# EAGLE design Qwiic_RF (EAGLE 7.7.0)
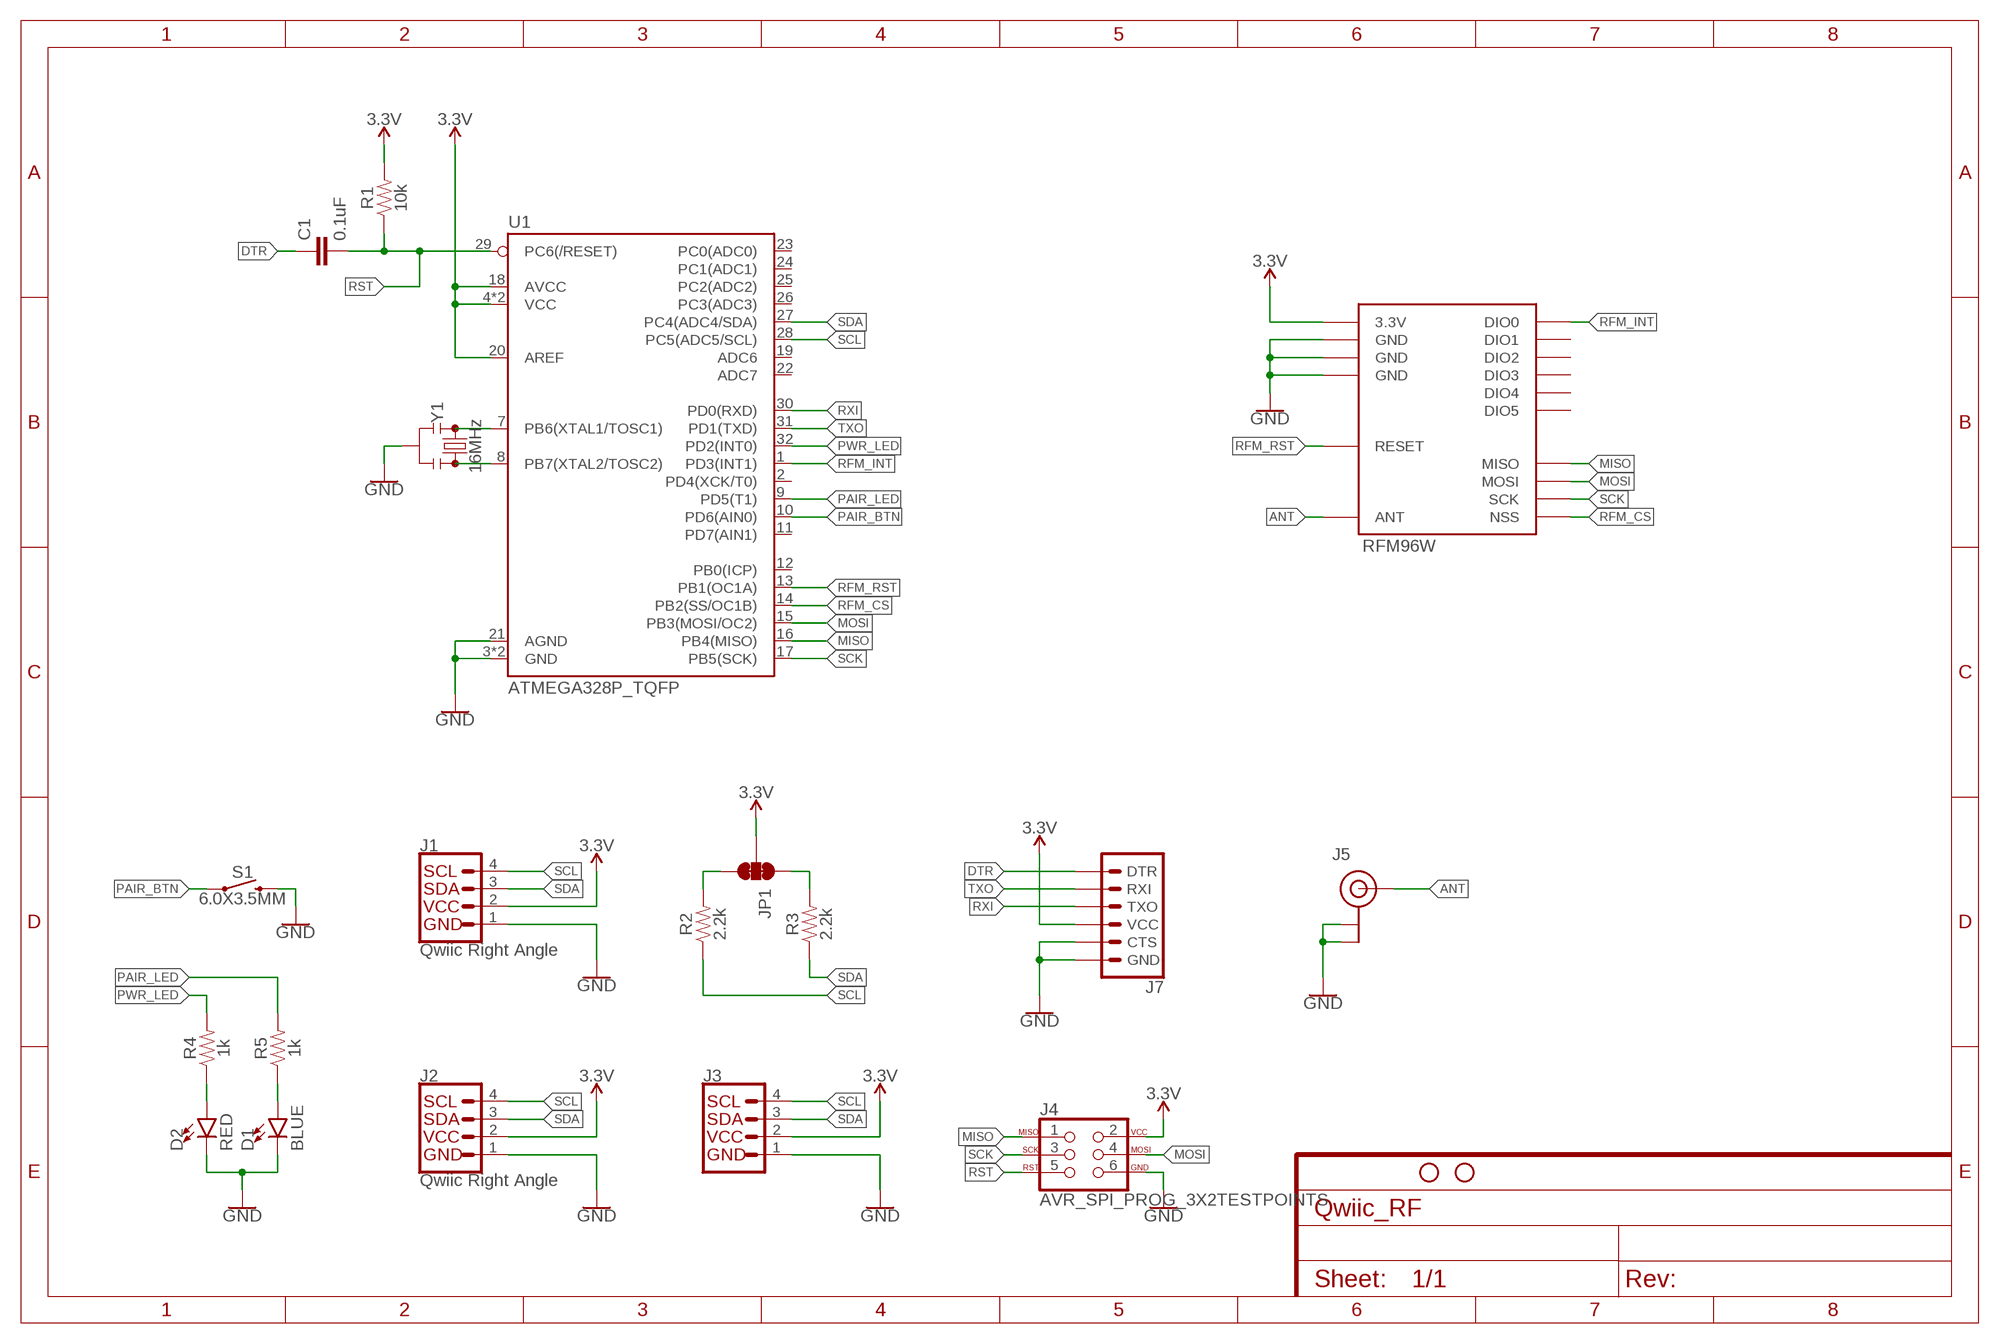
[diagram p0: schematic, sheet 1]

## Parts
C1  0.1uF  0.1UF-0603-25V-(+80/-20%)  [0603]
D1  BLUE  LED-BLUE0603  [LED-0603]
D2  RED  LED-RED0603  [LED-0603]
H1  STAND-OFF  [STAND-OFF]
H2  STAND-OFF  [STAND-OFF]
J1  Qwiic Right Angle  I2C_STANDARDQWIIC  [1X04_1MM_RA]
J2  Qwiic Right Angle  I2C_STANDARDQWIIC  [1X04_1MM_RA]
J3  I2C_STANDARD  [1X04]
J4  AVR_SPI_PROG_3X2TESTPOINTS  [2X3_TEST_POINTS]
J5  U.FL  [U.FL]
J7  6_PIN_SERIAL_TARGET  [1X06]
JP1  JUMPER-SMT_3_2-NC_TRACE_SILK  [SMT-JUMPER_3_2-NC_TRACE_SILK]
R1  10k  10KOHM-0603-1/10W-1%  [0603]
R2  2.2k  2.2KOHM-0603-1/10W-1%  [0603]
R3  2.2k  2.2KOHM-0603-1/10W-1%  [0603]
R4  1k  1KOHM-0603-1/10W-1%  [0603]
R5  1k  1KOHM-0603-1/10W-1%  [0603]
RFM96W  RFM96W  [RFM95/96/97/98W]
S1  6.0X3.5MM  MOMENTARY-SWITCH-SPST-SMD-6.0X3.5MM  [TACTILE_SWITCH_SMD_6.0X3.5MM]
U1  ATMEGA328P_TQFP  [TQFP32-08]
Y1  16MHz  RESONATOR-16MHZSMD_3.2X1.3  [RESONATOR-SMD-3.2X1.3]

## Nets
3.3V: J1.2 J2.2 J3.2 J4.2 J7.4(VCC) JP1.2 R1.2 RFM96W.3.3V U1.4(VCC) U1.6(VCC) U1.18(AVCC) U1.20(AREF)
ANT: J5.FEED(SIGNAL) RFM96W.ANT
DTR: C1.1 J7.1(DTR)
GND: D1.C D2.C J1.1 J2.1 J3.1 J4.6 J5.1(GND) J5.2(GND) J7.5(CTS) J7.6(GND) RFM96W.GND@1(GND) RFM96W.GND@2(GND) RFM96W.GND@3(GND) S1.2 U1.3(GND) U1.5(GND) U1.21(AGND) Y1.2
MISO: J4.1 RFM96W.MISO U1.16(PB4(MISO))
MOSI: J4.4 RFM96W.MOSI U1.15(PB3(MOSI/OC2))
N$1: D2.A R4.1
N$2: D1.A R5.1
N$4: U1.7(PB6(XTAL1/TOSC1)) Y1.1
N$5: U1.8(PB7(XTAL2/TOSC2)) Y1.3
N$7: JP1.1 R3.2
N$8: JP1.3 R2.2
PAIR_BTN: S1.1 U1.10(PD6(AIN0))
PAIR_LED: R5.2 U1.9(PD5(T1))
PWR_LED: R4.2 U1.32(PD2(INT0))
RFM_CS: RFM96W.NSS U1.14(PB2(SS/OC1B))
RFM_INT: RFM96W.DIO0 U1.1(PD3(INT1))
RFM_RST: RFM96W.RESET U1.13(PB1(OC1A))
RST: C1.2 J4.5 R1.1 U1.29(PC6(/RESET))
RXI: J7.3(TXO) U1.30(PD0(RXD))
SCK: J4.3 RFM96W.SCK U1.17(PB5(SCK))
SCL: J1.4 J2.4 J3.4 R2.1 U1.28(PC5(ADC5/SCL))
SDA: J1.3 J2.3 J3.3 R3.1 U1.27(PC4(ADC4/SDA))
TXO: J7.2(RXI) U1.31(PD1(TXD))
Unconnected: RFM96W.DIO1 RFM96W.DIO2 RFM96W.DIO3 RFM96W.DIO4 RFM96W.DIO5 U1.2(PD4(XCK/T0)) U1.11(PD7(AIN1)) U1.12(PB0(ICP)) U1.19(ADC6) U1.22(ADC7) U1.23(PC0(ADC0)) U1.24(PC1(ADC1)) U1.25(PC2(ADC2)) U1.26(PC3(ADC3))

## Library data of the parts
C1 = SparkFun-Capacitors:0.1UF: 0.1µF ceramic capacitors A capacitor is a passive two-terminal electrical component used to store electrical energy temporarily in an electric field.; PROD_ID: CAP-00810
D1 = SparkFun-LED:LED-BLUE: Blue SMD LED Used in manufacturing of various products at SparkFun Packages: 0603 - SMD 0603 package [Product Link] <http://www.digikey.com/product-detail/en/SMLE12BC7TT86/511-1589-2-ND/1641808> 1206 - SMD1206 package [Product Link] <http://www.digikey.com/product-detail/en/lite-on-inc/LTST-C150TBKT/160-1643-1-ND/573584> SparkFun Products: ESP8266 Thing-Dev Board <https://www.sparkfun.com/products/13711> RedBoard <https://www.sparkfun.com/products/12757>; PROD_ID: DIO-08575
D2 = SparkFun-LED:LED-RED: Red SMD LED Used in manufacturing of most products at SparkFun Packages: 0603 - SMD 0603 package [Product Link] <http://docs.avagotech.com/docs/AV02-0551EN> 0603 SMART - SMD 0603 SMART package ( more efficient and expensive)[Product Link] <http://www.osram-os.com/Graphics/XPic2/00077099_0.pdf> 1206 - SMD1206 package [Product Link] <https://www.sparkfun.com/datasheets/DevTools/LilyPad/Q150OVS4.pdff> SparkFun Products: Pro Mini 328 -5V <https://www.sparkfun.com/products/821> RedBoard <https://www.sparkfun.com/products/12757> IOIO-OTG <https://www.sparkfun.com/products/13613>; PROD_ID: DIO-00819
H1 H2 = SparkFun-Hardware:STAND-OFF: Stand Off Drill holes for mechanically mounting via screws, standoffs, etc. Note: Use the keepout ring to avoid running the screw head into surrounding components. Variant Overviews STAND-OFF - Mechanical footprint for a #4 phillips button head screw. STAND-OFF-TIGHT - Mechanical footprint for a #4 phillips button head screw, Example SparkFun Products Screw - Phillips Head (1/4", 4-40, 10 pack) <https://www.sparkfun.com/products/10453> (PRT-10453) Screw - Phillips Head (1/2", 4-40, 10 pack) <https://www.sparkfun.com/products/10452> (PRT-10452) Screw - Phillips Head (3/4", 4-40, 10 pack) <https://www.sparkfun.com/products/10451> (PRT-10451) Screw - Phillips Head (1", 4-40, 10 pack) <https://www.sparkfun.com/products/10450> (PRT-10450)
J1 J2 = SparkFun-Connectors:I2C_STANDARD: SparkFun I2C Standard Pinout Header SparkFun has standardized on a pinout for all I2C based sensor breakouts. This pinout allows I2C boards to be plugged directly into the headers on Arduino Uno compatible boards, and to be daisy chained easily. Example SparkFun Products: SparkFun Atmospheric Sensor Breakout - BME280 <https://www.sparkfun.com/products/13676> SparkFun Altitude/Pressure Sensor Breakout - MPL3115A2 <https://www.sparkfun.com/products/11084> SparkFun TOF Range Finder Sensor - VL6180 <https://www.sparkfun.com/products/12785>; PROD_ID: CONN-13694
J3 = SparkFun-Connectors:I2C_STANDARD: SparkFun I2C Standard Pinout Header SparkFun has standardized on a pinout for all I2C based sensor breakouts. This pinout allows I2C boards to be plugged directly into the headers on Arduino Uno compatible boards, and to be daisy chained easily. Example SparkFun Products: SparkFun Atmospheric Sensor Breakout - BME280 <https://www.sparkfun.com/products/13676> SparkFun Altitude/Pressure Sensor Breakout - MPL3115A2 <https://www.sparkfun.com/products/11084> SparkFun TOF Range Finder Sensor - VL6180 <https://www.sparkfun.com/products/12785>
J4 = SparkFun-Connectors:AVR_SPI_PROG_3X2: AVR ISP 6 Pin This is the reduced ISP connector for AVR programming. Common on Arduino. This footprint will take up less PCB space and can be used with a 10-pin to 6-pin adapter such as SKU: BOB-08508 **Special note about "TEST_POINT" package. The stop mask is on the top side, so if you want your programming test points to be on the bottom of your board, make sure to place this package on the bottom side of the board. This also ensure that the orientation to program from the bottom side will be correct. SparkFun Products: SparkFun ISP Pogo Adapter <https://www.sparkfun.com/products/11591> - NS Tiny AVR Programmer <https://www.sparkfun.com/products/11801> -PTH
J5 = SparkFun-Connectors:U.FL: SMD Antenna Connector - U.FL 2mm height, 3.0mm x 3.0mm receptacle size. SparkFun Products: SparkFun WiFi Shield - ESP8266 <https://www.sparkfun.com/products/13287> SparkFun ESP8266 Thing <https://www.sparkfun.com/products/13231> SparkFun MiniGen - Pro Mini Signal Generator Shield <https://www.sparkfun.com/products/11420>; PROD_ID: CONN-09193; SF_ID: WRL-09144
J7 = SparkFun-Connectors:6_PIN_SERIAL_TARGET: 6-pin header connection for use with the "FTDI BASIC" pinout - TARGET SIDE. Also known as "Arduino Serial Program Header". It is used to mate with our FTDI Basic serial programmers using the Arduino IDE. Note, this device has "TARGET" in the name. It is intended to be used on a design that contains a target micro-controller that you wish to program. The "sister" device, named "CABLE" is inteneded to be used on a design that usually lives on the end of your USB cable and prvides the converter chip (FTDI232 or FTDI231x) to commnicate serial RX/TX. You can populate with some of these: Break Away Headers - Straight <https://www.sparkfun.com/products/116> (PRT-00116) For reference (or to suit your programming needs) check out these designs: SparkFun FTDI Basic Breakout - 5V <https://www.sparkfun.com/products/9716> (DEV-09716) SparkFun FTDI Basic Breakout - 3.3V <https://www.sparkfun.com/products/9873> (DEV-09873) SparkFun FTDI SmartBasic <https://www.sparkfun.com/products/12935> (DEV-12935) SparkFun Beefy 3 - FTDI Basic Breakout <https://www.sparkfun.com/products/13746> (DEV-13746)
JP1 = SparkFun-Jumpers:JUMPER-SMT_3_2-NC_TRACE: Normally closed trace jumper (2 of 2 connections) This jumper has a trace between all three pads so they are normally closed (NC). Use a razor knife to open the connection(s). For best results follow the IPC guidelines for cutting traces: Cutout at least 0.063 mm (0.005 in). Remove all loose material to clean up the cut area. Seal the cut with an approved epoxy. Reapply solder to reclose the connection(s).
R1 = SparkFun-Resistors:10KOHM: 10kΩ resistor A resistor is a passive two-terminal electrical component that implements electrical resistance as a circuit element. Resistors act to reduce current flow, and, at the same time, act to lower voltage levels within circuits. - Wikipedia; PROD_ID: RES-00824
R2 R3 = SparkFun-Resistors:2.2KOHM: 2.2kΩ resistor A resistor is a passive two-terminal electrical component that implements electrical resistance as a circuit element. Resistors act to reduce current flow, and, at the same time, act to lower voltage levels within circuits. - Wikipedia; PROD_ID: RES-08272
R4 R5 = SparkFun-Resistors:1KOHM: 1kΩ resistor A resistor is a passive two-terminal electrical component that implements electrical resistance as a circuit element. Resistors act to reduce current flow, and, at the same time, act to lower voltage levels within circuits. - Wikipedia; PROD_ID: RES-07856
RFM96W = SparkX:RFM96W
S1 = SparkFun-Switches:MOMENTARY-SWITCH-SPST: Momentary Switch (Pushbutton) - SPST Normally-open (NO) SPST momentary switches (buttons, pushbuttons). Variants PTH-12MM - 12mm square, through-hole Momentary Pushbutton Switch - 12mm Square <https://www.sparkfun.com/products/9190> (COM-09190) PTH-6.0MM, PTH-6.0MM-KIT - 6.0mm square, through-hole Mini Pushbutton Switch <https://www.sparkfun.com/products/97> (COM-00097) KIT package intended for soldering kit's - only one side of pads' copper is exposed. PTH-RIGHT-ANGLE-KIT - Right-angle, through-hole Right Angle Tactile Button <https://www.sparkfun.com/products/10791> - Used on SparkFun BigTime Watch Kit <https://www.sparkfun.com/products/11734> SMD-12MM - 12mm square, surface-mount Tactile Button - SMD (12mm) <https://www.sparkfun.com/products/12993> (COM-12993) Used on SparkFun PicoBoard <https://www.sparkfun.com/products/11888> SMD-4.5MM - 4.5mm Square Trackball Switch Used on SparkFun Blackberry Trackballer Breakout <https://www.sparkfun.com/products/13169> SMD-4.6MMX2.8MM - 4.60mm x 2.80mm, surface mount Used on SparkFun SAMD21 Mini Breakout <https://www.sparkfun.com/products/13664> SMD-5.2MM, SMD-5.2-REDUNDANT - 5.2mm square, surface-mount Mini Pushbutton Switch - SMD <https://www.sparkfun.com/products/8720> (COM-08720) Used on Arduino Pro Mini <https://www.sparkfun.com/products/11114> REDUNDANT package connects both switch circuits together SMD-6.0X3.5MM - 6.0 x 3.5mm, surface mount Momentary Reset Switch SMD <https://www.sparkfun.com/products/8229> (COM-08229) SMD-6.2MM-TALL - 6.2mm square, surface mount Tactile Button - SMD (6mm) <https://www.sparkfun.com/products/12992> Used on SparkFun Digital Sandbox <https://www.sparkfun.com/products/12651> SMD-RIGHT-ANGLE - Right-angle, surface mount Used on SparkFun Block for Intel® Edison - Arduino <https://www.sparkfun.com/products/13036>; PROD_ID: SWCH-00815; SF_SKU: COM-08229
U1 = SparkFun-IC-Microcontroller:ATMEGA328P_TQFP: Popular 328P in QFP Storefront component: ATmega328 - TQFP <https://www.sparkfun.com/products/13448> (COM-13448) Datasheet <http://www.sparkfun.com/datasheets/Components/SMD/ATMega328.pdf> SparkFun Products SparkFun RedBoard - Programmed with Arduino <https://www.sparkfun.com/products/12757> (DEV-12757) Arduino Pro Mini 328 - 5V/16MHz <https://www.sparkfun.com/products/11113> (DEV-11113) Arduino Pro Mini 328 - 3.3V/8MHz <https://www.sparkfun.com/products/11114> (DEV-11114) SparkFun OpenLog <https://www.sparkfun.com/products/13712> (DEV-13712) SparkFun MicroView - OLED Arduino Module <https://www.sparkfun.com/products/12923> (DEV-12923) SparkFun Digital Sandbox <https://www.sparkfun.com/products/12651> (DEV-12651) SparkFun PicoBoard <https://www.sparkfun.com/products/11888> (WIG-11888) Arduino Fio <https://www.sparkfun.com/products/10116> (DEV-10116) LilyPad Arduino 328 Main Board <https://www.sparkfun.com/products/13342> (DEV-13342) SparkFun RedStick <https://www.sparkfun.com/products/13741> (DEV-13741) LilyPad MP3 <https://www.sparkfun.com/products/11013> (DEV-11013) LilyPad Arduino SimpleSnap <https://www.sparkfun.com/products/10941> (DEV-10941) SparkFun Stepoko <https://www.sparkfun.com/products/13899> (ROB-13899) SparkFun Geiger Counter <https://www.sparkfun.com/products/11345> (SEN-11345) SparkFun EL Sequencer <https://www.sparkfun.com/products/12781> (COM-12781) Arduino Pro 328 - 5V/16MHz <https://www.sparkfun.com/products/10915> (DEV-10915) CryptoCape <https://www.sparkfun.com/products/12773> (DEV-12773) SparkFun IR Thermometer Evaluation Board - MLX90614 <https://www.sparkfun.com/products/10740> (SEN-10740) SparkFun RedBot Mainboard <https://www.sparkfun.com/products/12097> (ROB-12097) Arduino Pro 328 - 3.3V/8MHz <https://www.sparkfun.com/products/10914> (DEV-10914) SparkFun Block for Intel® Edison - Arduino <https://www.sparkfun.com/products/13036> (DEV-13036) SparkFun Simon Says - Surface Mount Soldering Kit <https://www.sparkfun.com/products/10935> (KIT-10935) SparkFun 7-Segment Serial Display - Red <https://www.sparkfun.com/products/11441> (COM-11441) SparkFun 7-Segment Serial Display - White <https://www.sparkfun.com/products/11629> (COM-11629) SparkFun 7-Segment Serial Display - Yellow <https://www.sparkfun.com/products/11443> (COM-11443) SparkFun 7-Segment Serial Display - Kelly Green <https://www.sparkfun.com/products/11440> (COM-11440) SparkFun 7-Segment Serial Display - Blue <https://www.sparkfun.com/products/11442> (COM-11442) SparkFun OpenSegment Serial Display - 20mm (Blue) <https://www.sparkfun.com/products/11647> (COM-11647) SparkFun OpenSegment Serial Display - 20mm (Green) <https://www.sparkfun.com/products/11646> (COM-11646) SparkFun OpenSegment Serial Display - 20mm (White) <https://www.sparkfun.com/products/11648> (COM-11648) SparkFun OpenSegment Serial Display - 20mm (Red) <https://www.sparkfun.com/products/11644> (COM-11644) SparkFun OpenSegment Serial Display - 20mm (Yellow) <https://www.sparkfun.com/products/11645> (COM-11645) SparkFun OpenSegment Shield <https://www.sparkfun.com/products/13190> (DEV-13190); PROD_ID: IC-09069
Y1 = SparkFun-Clocks:RESONATOR-16MHZ: 16MHz Resonator Digikey Example <http://www.digikey.com/product-detail/en/murata-electronics-north-america/CSTCE16M0V53-R0/490-1198-1-ND/584635> Frequency: 16MHz Frequency Stability: ±0.3% Frequency Tolerance: ±0.5% Capacitance: 15pF SparkFun Products SparkFun OpenLog <https://www.sparkfun.com/products/13712> SparkFun MicroView - OLED Arduino Module <https://www.sparkfun.com/products/12923>; PROD_ID: XTAL-08900

## Board
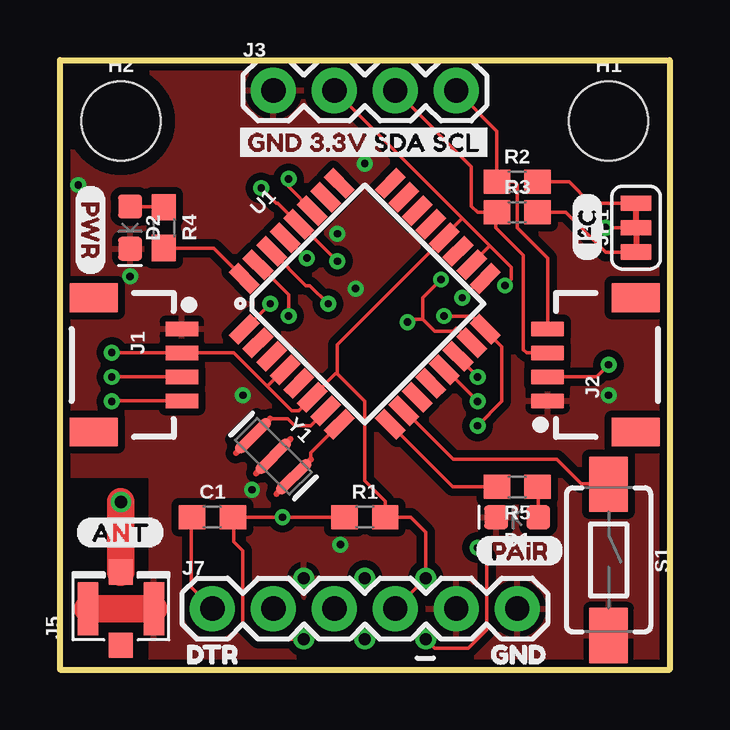
[diagram p1: board, top side]
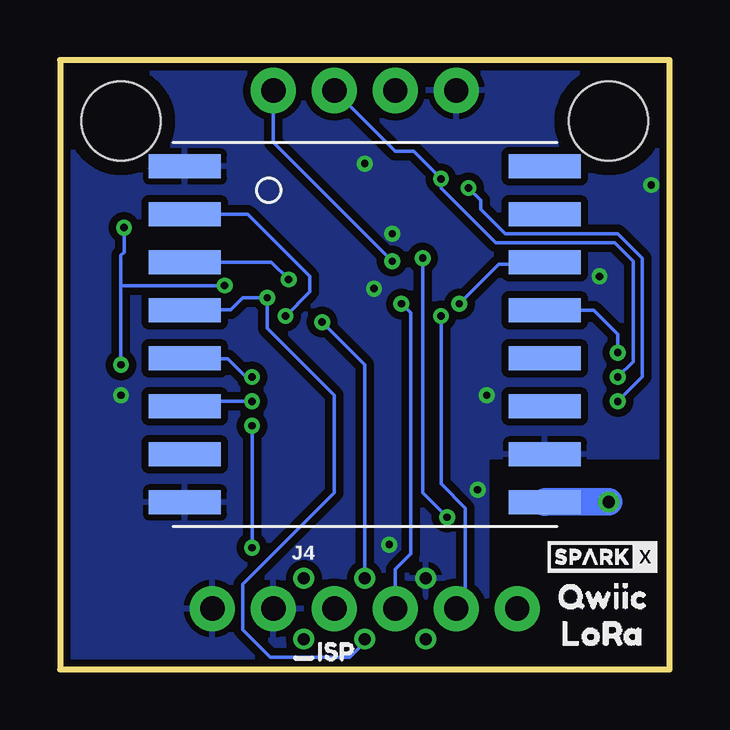
[diagram p2: board, bottom side, seen from below]

Size 25.4 x 25.4 mm. Coordinates in mm from the lower left corner, seen from the top.
Outline: 0,25.4 25.4,25.4 25.4,0 0,0 0,25.4
Copper layers (1*16): Top 0.035mm / dielectric 1.5mm / Bottom 0.035mm
Design rules "SparkFun-2-layer-PCBWay-LIMIT": minimum track width 6mil, minimum drill 0.3mm, track to track 6mil, track to pad 6mil, pad to pad 6mil, via to via 6mil, smd to smd 6mil, copper to edge 6mil, drill to drill 6mil, minimum pad ring 7mil, minimum via ring 7mil, stop-mask expansion 4mil, vias tented up to drill 25mil, thermal gap 10mil

### Footprints (pad centres in the part's own frame; a part is rotated, then mirrored left to right if it is on the bottom)
0603 = smd 1.1 x 1: 1 -0.85,0; 2 0.85,0
LED-0603 = smd 1 x 1: A -0.877,0; C 0.877,0
STAND-OFF = hole 3.302: 0,0
1X04_1MM_RA = smd 0.6 x 1.35: 1 -1.5,0; 2 -0.5,0; 3 0.5,0; 4 1.5,0 | smd 1.2 x 2: NC1 2.8,-3.675; NC2 -2.8,-3.675
1X04 = drill 1.016 pad 1.88: 1 0,0; 2 2.54,0; 3 5.08,0; 4 7.62,0
2X3_TEST_POINTS = drill 0.508: 1 -2.54,-1.27; 2 -2.54,1.27; 3 0,-1.27; 4 0,1.27; 5 2.54,-1.27; 6 2.54,1.27
U.FL = smd 2.2 x 0.85: 1 0,1.375; 2 0,-1.375 | smd 1.05 x 1: FEED 1.525,0; NC -1.525,0
1X06 = drill 1.016 pad 1.88: 1 0,0; 2 2.54,0; 3 5.08,0; 4 7.62,0; 5 10.16,0; 6 12.7,0
SMT-JUMPER_3_2-NC_TRACE_SILK = smd 0.635 x 1.27: 1 -1.016,0; 2 0,0; 3 1.016,0
RFM95/96/97/98W = smd 3 x 1: 3.3V 7.5,1; ANT 7.5,-7; DIO0 7.5,3; DIO1 7.5,5; DIO2 7.5,7; DIO3 7.5,-3; DIO4 7.5,-1; DIO5 -7.5,-5; GND@1 -7.5,7; GND@2 -7.5,-7; GND@3 7.5,-5; MISO -7.5,5; MOSI -7.5,3; NSS -7.5,-1; RESET -7.5,-3; SCK -7.5,1
TACTILE_SWITCH_SMD_6.0X3.5MM = smd 2.3 x 1.6: 1 -3.15,0; 2 3.15,0
TQFP32-08 = smd 1.27 x 0.559: 1 -4.293,2.8; 2 -4.293,2; 3 -4.293,1.2; 4 -4.293,0.4; 5 -4.293,-0.4; 6 -4.293,-1.2; 7 -4.293,-2; 8 -4.293,-2.8; 17 4.293,-2.8; 18 4.293,-2; 19 4.293,-1.2; 20 4.293,-0.4; 21 4.293,0.4; 22 4.293,1.2; 23 4.293,2; 24 4.293,2.8 | smd 0.559 x 1.27: 9 -2.8,-4.293; 10 -2,-4.293; 11 -1.2,-4.293; 12 -0.4,-4.293; 13 0.4,-4.293; 14 1.2,-4.293; 15 2,-4.293; 16 2.8,-4.293; 25 2.8,4.293; 26 2,4.293; 27 1.2,4.293; 28 0.4,4.293; 29 -0.4,4.293; 30 -1.2,4.293; 31 -2,4.293; 32 -2.8,4.293
RESONATOR-SMD-3.2X1.3 = smd 0.45 x 1.905: 1 -1.2,0; 2 0,0; 3 1.2,0

### Placement (x,y rotation side)
C1  6.35,6.35 0 top
D1  19.05,6.35 180 top
D2  2.92,18.41 270 top
H1  22.86,22.86 0 top
H2  2.54,22.86 0 top
J1  5.08,12.7 270 top
J2  20.32,12.7 90 top
J3  8.89,24.13 0 top
J4  12.7,2.54 0 bottom
J5  2.54,2.54 90 top
J7  6.35,2.54 0 top
JP1  24,18.41 90 top
R1  12.7,6.35 0 top
R2  19.05,20.32 0 top
R3  19.05,19.05 0 top
R4  4.32,18.41 270 top
R5  19.05,7.62 180 top
RFM96W  12.7,13.97 0 bottom
S1  22.86,4.57 270 top
U1  12.7,15.24 45 top
U$1  [ANT5]  0.64,5.71 0 top
U$2  [DTR3]  4.57,0.64 0 top
U$3  [GND4]  17.27,0.64 0 top
U$4  [GND_3#3V_SDA_SCL6]  7.11,21.97 0 top
U$5  [I#C2]  21.97,17.02 90 top
U$6  [PAIR1]  17.27,4.95 0 top
U$7  [PWR0]  1.27,20.19 270 top
U$8  [SPARKX-TINY]  2.79,4.7 0 bottom
U$9  [QWIIC0]  5.59,3.05 0 bottom
U$10  [LORA1]  5.46,1.52 0 bottom
U$11  [ISP0]  15.37,0.76 0 bottom
Y1  8.89,8.89 315 top

### Tracks (layer width: path | path; a pad name or v marks a point on that pad's centre or on a via)
3.3V  (via drill 0.3)
  Top 0.152: J7.4 J4.2 15.24,5.71 14.61,6.35 R1.2 13.55,7.02 12.7,7.87 12.7,11.18 11.56,12.32 | v2.16,13.21 J1.2 7.25,13.2 8.64,11.81 | J2.2 22.36,12.2 v22.86,12.7 | v22.73,18.41 JP1.2 | 11.56,12.32 11.48,12.32 U1.6 9.95,10.79 9.65,10.79 8.64,11.81 | U1.18 17.15,16.9 17.91,17.65 | 16.76,18.8 16.02,18.05 U1.20 11.56,13.53 11.56,12.32 | 16.76,18.8 17.91,17.65 | J3.2 16.76,18.8 | U1.4 9.31,12.49 8.64,11.81 | 17.91,17.65 18.8,16.76 18.8,16.26 v18.54,16
  Bottom 0.152: v2.16,13.21 2.16,13.97 3.16,14.97 RFM96W.3.3V 5.22,14.99 | v22.86,12.7 22.86,16 | v18.54,16 22.86,16 | 22.86,16 22.86,17.27 22.73,17.4 v22.73,18.41
ANT  (via drill 0.51)
  Top 1.143: J5.FEED v2.54,6.99
  Bottom 1.143: v2.54,6.99 5.18,6.99 RFM96W.ANT
DTR
  Top 0.152: J7.1 5.46,3.43 5.46,6.31 C1.1
GND  (via drill 0.3)
  Top 1.143: J5.1 J5.2
  other vias: 8,7.49 11.68,5.21 22.86,11.43 12.32,15.88 11.56,18.16 7.62,11.43 12.7,21.08 0.76,20.19 2.92,16.38
  pour Bottom (isolate 0.305): 0,8.89 0,25.4 25.4,25.4 25.4,0 7.62,0 7.62,8.89
  pour Top (isolate 0.305): 0,8.13 3.81,8.13 3.81,0 25.4,0 25.4,25.4 0,25.4
MISO  (via drill 0.3)
  Top 0.152: v16,14.73 17.17,14.73 U1.16 17.71,14.16 18.41,13.46 18.41,11.18 v17.4,10.16 | J4.1 15.62,0.89 17.02,0.89 17.78,1.65 17.78,4.7 v17.4,5.08
  Bottom 0.152: RFM96W.MISO 17.57,18.97 14.99,16.38 14.99,15.75 v16,14.73 | v17.4,10.16 v17.4,5.08
MOSI  (via drill 0.3)
  Top 0.152: v15.88,16.26 15.11,15.49 15.11,14.61 | 15.11,14.61 15.62,14.1 16.38,14.1 16.51,14.22 16.54,14.22 U1.15 | v14.48,14.48 14.61,14.61 15.11,14.61
  Bottom 0.152: RFM96W.MOSI 16.59,16.97 v15.88,16.26 | J4.4 12.7,12.7 v14.48,14.48
N$1
  Top 0.152: D2.A 4.29,19.29 R4.1
N$2
  Top 0.152: D1.A 19.93,7.59 R5.1
N$4
  Top 0.152: 8.76,10.46 9.48,10.46 9.78,10.16 10.45,10.16 U1.7
N$5
  Top 0.152: 10.46,8.76 10.46,9.04 U1.8
N$7
  Top 0.152: R3.2 21.08,19.05 22.73,17.4 JP1.1
N$8
  Top 0.152: R2.2 21.21,20.32 22.1,19.43 JP1.3
PAIR_BTN
  Top 0.152: U1.10 14.36,10.79 16.38,8.76 20.7,8.76 21.72,7.75 22.84,7.75 S1.1
PAIR_LED
  Top 0.152: R5.2 16.36,7.62 U1.9
PWR_LED
  Top 0.152: R4.2 6.42,17.57 U1.32
RFM_CS  (via drill 0.3)
  Top 0.152: U1.14 16.58,13.01 v17.4,12.19
  Bottom 0.152: v17.4,12.19 17.65,12.19 18.41,12.95 20.18,12.95 RFM96W.NSS
RFM_INT  (via drill 0.3)
  Top 0.152: U1.1 7.71,14.19 v8.76,15.24
  Bottom 0.152: v8.76,15.24 7.11,16.89 5.28,16.89 RFM96W.DIO0
RFM_RST  (via drill 0.3)
  Top 0.152: U1.13 16.09,12.49 v17.4,11.18
  Bottom 0.152: v17.4,11.18 19.99,11.18 RFM96W.RESET
RST  (via drill 0.3)
  Top 0.152: J4.5 8.26,1.27 7.62,1.91 7.62,4.95 7.24,5.33 7.24,6.31 C1.2 v9.27,6.35 R1.1 | U1.29 9.44,17.99 v10.29,17.14
  Bottom 0.152: v10.29,17.14 10.29,7.37 v9.27,6.35
RXI  (via drill 0.3)
  Top 0.152: v11.18,15.24 10.41,16 10.24,16 U1.30
  Bottom 0.152: J7.3 11.43,4.19 10.79,4.83 10.79,14.86 v11.18,15.24
SCK  (via drill 0.3)
  Top 0.152: U1.17 17.57,16.3 v16.76,15.49
  Bottom 0.152: RFM96W.SCK 20.18,14.99 18.29,14.99 17.78,15.49 v16.76,15.49 16.76,14.22 13.97,11.43 13.97,7.37 17.78,3.56 17.78,1.65 16.64,0.51 13.34,0.51 12.7,1.14 J4.3
SCL  (via drill 0.3)
  Top 0.152: J2.4 20.32,17.14 19.05,18.41 19.05,20.19 18.92,20.32 R2.1 18.2,22.44 J3.4 | v11.56,17.02 10.02,18.56 U1.28 9.07,19.43 9.02,19.43 v8.38,20.07 | J1.4 2.18,11.2 v2.16,11.18
  Bottom 0.152: v11.56,17.02 16.51,21.97 J3.4 | v2.16,11.18 1.14,12.19 1.14,17.14 2.16,18.16 6.86,18.16 7.87,19.18 7.87,19.56 v8.38,20.07
SDA  (via drill 0.3)
  Top 0.152: J2.3 19.44,13.2 19.3,13.34 19.3,17.27 18.16,18.41 18.16,19.01 R3.1 17.4,19.05 17.14,19.3 17.14,20.95 J3.3 | J1.3 v2.17,12.2 v2.16,12.19 | v9.53,20.45 9.53,20.11 U1.27
  Bottom 0.152: v2.16,12.19 1.52,12.83 1.52,17.02 2.29,17.78 7.24,17.78 9.53,20.07 v9.53,20.45 10.67,21.59 11.43,21.59 J3.3
TXO  (via drill 0.3)
  Top 0.152: U1.31 8.29,16.86 9.53,15.62 v9.53,14.73
  Bottom 0.152: v9.53,14.73 9.53,7.75 8.51,6.73 8.51,2.92 J7.2